# EAGLE design Main (EAGLE 9.6.2)
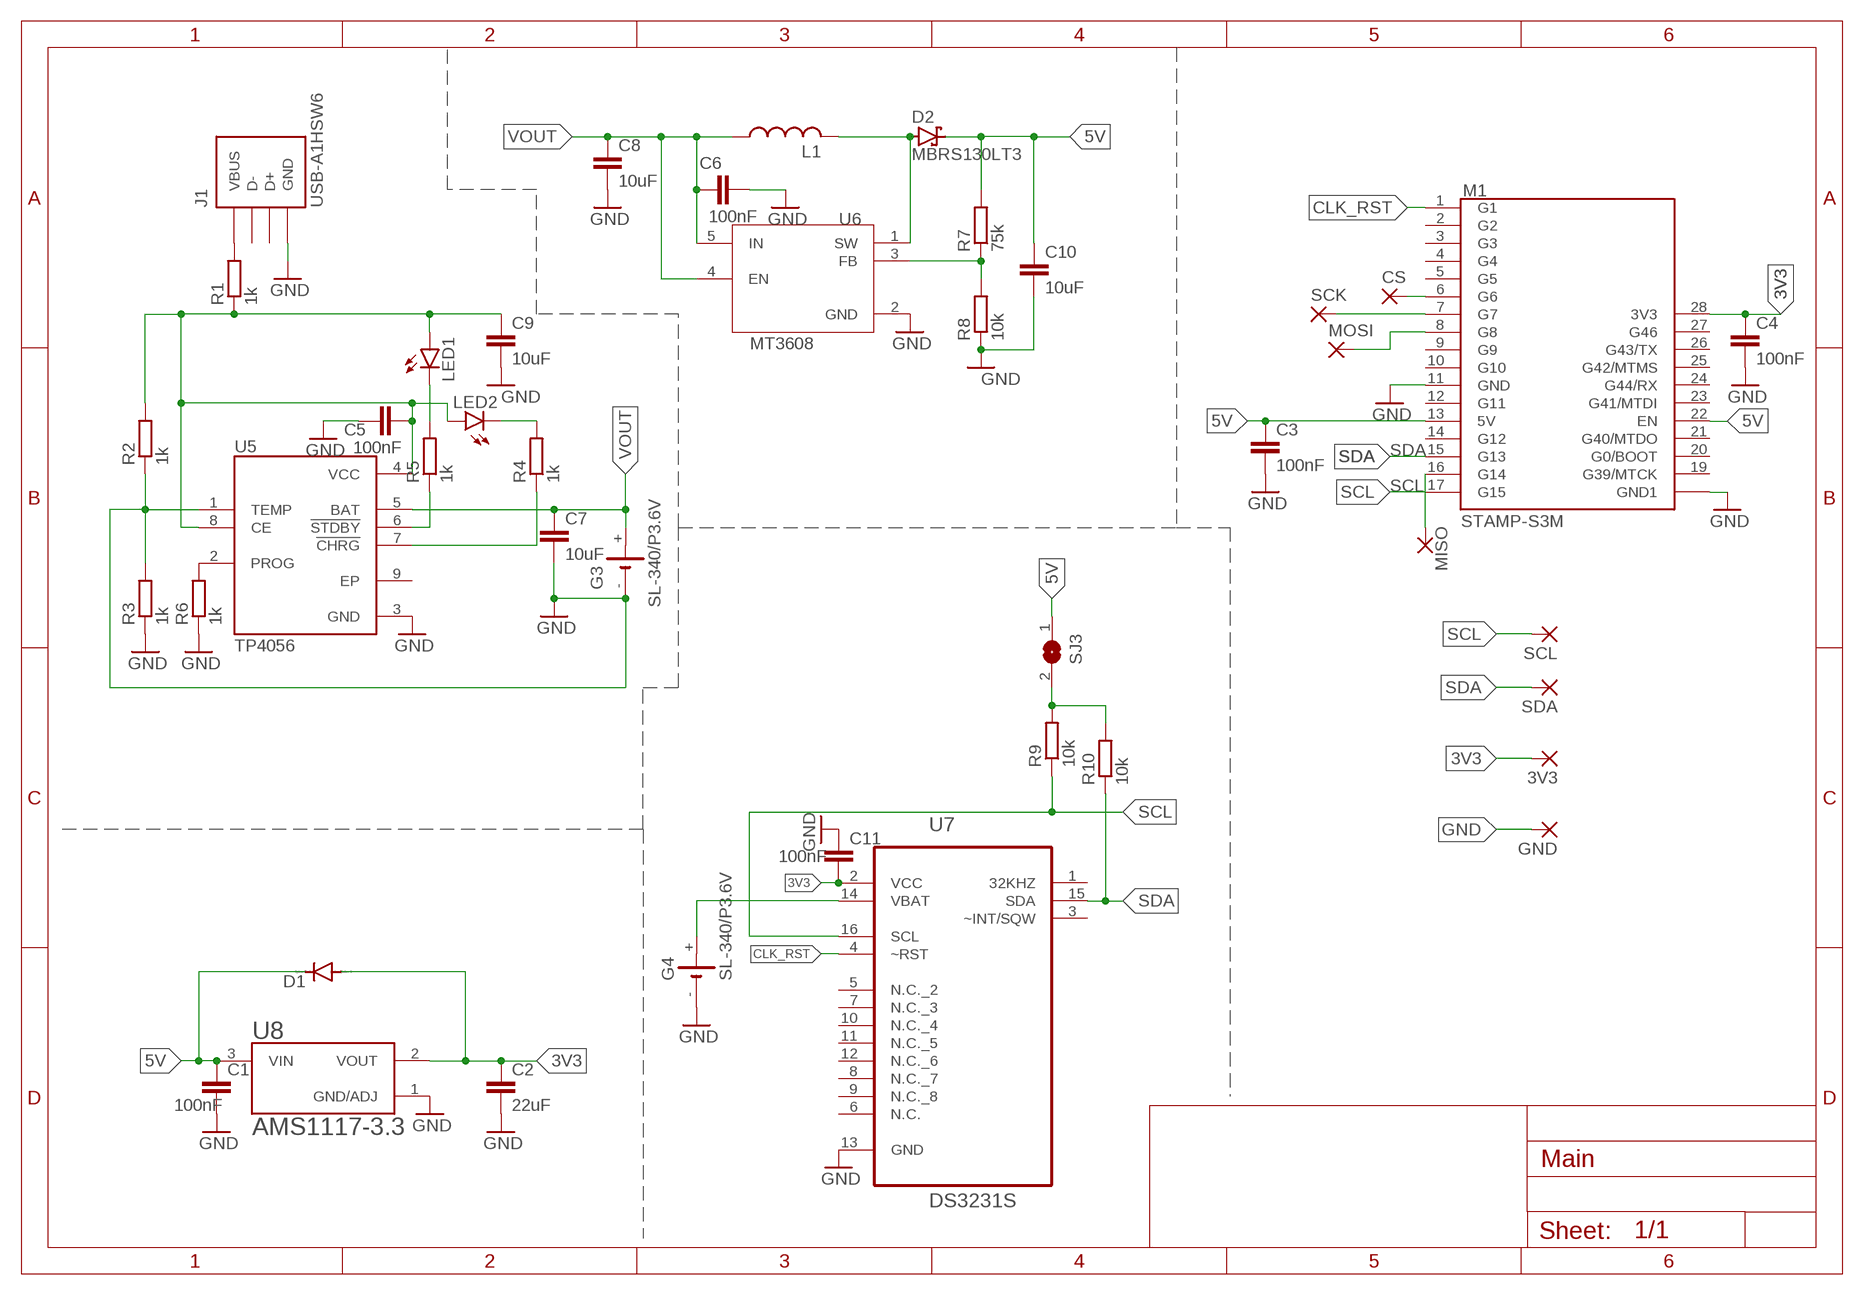
[diagram p0: schematic, sheet 1]

## Parts
3V3  1,6/0,8  [1,6/0,8]
C1  100nF  C-EUC0402  [C0402]
C2  22uF  C-EUC0402  [C0402]
C3  100nF  C-EUC0402  [C0402]
C4  100nF  C-EUC0402  [C0402]
C5  100nF  C-EUC0402  [C0402]
C6  100nF  C-EUC0402  [C0402]
C7  10uF  C-EUC0402  [C0402]
C8  10uF  C-EUC0402  [C0402]
C9  10uF  C-EUC0402  [C0402]
C10  10uF  C-EUC0402  [C0402]
C11  100nF  C-EUC0402  [C0402]
CS  1,6/0,8  [1,6/0,8]
D1  DIODE-SMB  [SMB]
D2  MBRS130LT3  [SMB]
G3  SL-340/P3.6V  [SL-340/P3.6V]
G4  SL-340/P3.6V  [SL-340/P3.6V]
GND  1,6/0,8  [1,6/0,8]
J1  USB-A1HSW6  [OST_USB-A1HSW6]
L1  L-USL3225M  [L3225M]
LED1  LEDCHIPLED_0805  [CHIPLED_0805]
LED2  LEDCHIPLED_0805  [CHIPLED_0805]
MISO  1,6/0,8  [1,6/0,8]
MOSI  1,6/0,8  [1,6/0,8]
R1  1k  R-EU_M1206  [M1206]
R2  1k  R-EU_M1206  [M1206]
R3  1k  R-EU_M1206  [M1206]
R4  1k  R-EU_M1206  [M1206]
R5  1k  R-EU_M1206  [M1206]
R6  1k  R-EU_M1206  [M1206]
R7  75k  R-EU_M1206  [M1206]
R8  10k  R-EU_M1206  [M1206]
R9  10k  R-EU_M1206  [M1206]
R10  10k  R-EU_M1206  [M1206]
SCK  1,6/0,8  [1,6/0,8]
SCL  1,6/0,8  [1,6/0,8]
SDA  1,6/0,8  [1,6/0,8]
SJ3  SJ  [SJ]
U5  TP4056  [SOP127P600X175-9N]
U6  MT3608  [SOT95P280X145-6N]
U7  DS3231S  [SOIC127P1032X265-16N]
U8  AMS1117-3.3  [SOT229P700X180-4N]
U$1  STAMP-S3M-PIN  [STAMPS3_PIN_FTP]

## Nets
3V3: 3V3.1(P) C2.1 C4.1 C11.2 D1.A U7.2(VCC) U8.2(VOUT) U$1.28(3V3)
5V: C1.1 C3.1 C10.1 D1.C D2.C R7.2 SJ3.1 U8.3(VIN) U$1.13(5V) U$1.22(EN)
CHRG: R4.1 U5.7(!CHRG)
CHRG2: LED2.C R4.2
CLK_RST: U7.4(~RST) U$1.1(G1)
CS: CS.1(P) U$1.6(G6)
FB: R7.1 R8.2 U6.3(FB)
GND: C1.2 C2.2 C3.2 C4.2 C5.1 C6.2 C7.2 C8.2 C9.2 C10.2 C11.1 G3.- G4.- GND.1(P) J1.4(GND) R2.1 R3.1 R3.2 R6.1 R8.1 U5.1(TEMP) U5.3(GND) U6.2(GND) U7.13(GND) U8.1(GND/ADJ) U$1.11(GND) U$1.18(GND1)
JUMPER: R9.2 R10.2 SJ3.2
MISO: MISO.1(P) U$1.16(G14)
MOSI: MOSI.1(P) U$1.8(G8)
N$1: R6.2 U5.2(PROG)
N$2: LED1.C R5.2
N$3: J1.1(VBUS) R1.2
SCK: SCK.1(P) U$1.7(G7)
SCL: R9.1 SCL.1(P) U7.16(SCL) U$1.17(G15)
SDA: R10.1 SDA.1(P) U7.15(SDA) U$1.15(G13)
STDBY: R5.1 U5.6(!STDBY)
SW: D2.A L1.2 U6.1(SW)
USB1: C5.2 C9.1 LED1.A LED2.A R1.1 R2.2 U5.4(VCC) U5.8(CE)
VBAT: G4.+ U7.14(VBAT)
VOUT: C6.1 C7.1 C8.1 G3.+ L1.1 U5.5(BAT) U6.4(EN) U6.5(IN)
Unconnected: J1.2(D-) J1.3(D+) U5.9(EP) U7.1(32KHZ) U7.3(~INT/SQW) U7.5(N.C._2) U7.6(N.C.) U7.7(N.C._3) U7.8(N.C._7) U7.9(N.C._8) U7.10(N.C._4) U7.11(N.C._5) U7.12(N.C._6) U$1.2(G2) U$1.3(G3) U$1.4(G4) U$1.5(G5) U$1.9(G9) U$1.10(G10) U$1.12(G11) U$1.14(G12) U$1.19(G39/MTCK) U$1.20(G0/BOOT) U$1.21(G40/MTDO) U$1.23(G41/MTDI) U$1.24(G44/RX) U$1.25(G42/MTMS) U$1.26(G43/TX) U$1.27(G46)

## Library data of the parts
3V3 CS GND MISO MOSI SCK SCL SDA = wirepad:1,6/0,8: THROUGH-HOLE PAD
C1-C11 = rcl:C-EU: CAPACITOR, European symbol; SPICEPREFIX: C
D1 = diode:DIODE-: DIODE
D2 = diode:MBRS130LT3: Schottky Power Rectifier Source: http://www.onsemi.com/pub/Collateral/MBRS130LT3-D.PDF
G3 G4 = battery:SL-340/P3.6V: LI BATTERY Sonnenschein
J1 = USB-A1HSW6:USB-A1HSW6: Check availability <https://pricing.snapeda.com/parts/USB-A1HSW6/On%20Shore/view-part?ref=eda>; AVAILABILITY: In Stock; CHECK_PRICES: https://www.snapeda.com/parts/USB-A1HSW6/ON/view-part/?ref=eda; DESCRIPTION: USB-A (USB TYPE-A) - Receptacle Connector 4 Position Through Hole, Right Angle; MF: On Shore; MP: USB-A1HSW6; PACKAGE: None; PRICE: None; SNAPEDA_LINK: https://www.snapeda.com/parts/USB-A1HSW6/ON/view-part/?ref=snap
L1 = rcl:L-US: INDUCTOR, American symbol; SPICEPREFIX: L
LED1 LED2 = led:LED: LED OSRAM: - CHIPLED LG R971, LG N971, LY N971, LG Q971, LY Q971, LO R971, LY R971 LH N974, LH R974 LS Q976, LO Q976, LY Q976 LO Q996 - Hyper CHIPLED LW Q18S LB Q993, LB Q99A, LB R99A - SideLED LS A670, LO A670, LY A670, LG A670, LP A670 LB A673, LV A673, LT A673, LW A673 LH A674 LY A675 LS A676, LA A676, LO A676, LY A676, LW A676 LS A679, LY A679, LG A679 - Hyper Micro SIDELED® LS Y876, LA Y876, LO Y876, LY Y876 LT Y87S - SmartLED LW L88C, LW L88S LB L89C, LB L89S, LG L890 LS L89K, LO L89K, LY L89K LS L896, LA L896, LO L896, LY L896 - TOPLED LS T670, LO T670, LY T670, LG T670, LP T670 LSG T670, LSP T670, LSY T670, LOP T670, LYG T670 LG T671, LOG T671, LSG T671 LB T673, LV T673, LT T673, LW T673 LH T674 LS T676, LA T676, LO T676, LY T676, LB T676, LH T676, LSB T676, LW T676 LB T67C, LV T67C, LT T67C, LS T67K, LO T67K, LY T67K, LW E67C LS E67B, LA E67B, LO E67B, LY E67B, LB E67C, LV E67C, LT E67C LW T67C LS T679, LY T679, LG T679 LS T770, LO T770, LY T770, LG T770, LP T770 LB T773, LV T773, LT T773, LW T773 LH T774 LS E675, LA E675, LY E675, LS T675 LS T776, LA T776, LO T776, LY T776, LB T776 LHGB T686 LT T68C, LB T68C - Hyper Mini TOPLED® LB M676 - Mini TOPLED Santana® LG M470 LS M47K, LO M47K, LY M47K Source: http://www.osram.convergy.de LUXEON: - LUMILED® LXK2-PW12-R00, LXK2-PW12-S00, LXK2-PW14-U00, LXK2-PW14-V00 LXK2-PM12-R00, LXK2-PM12-S00, LXK2-PM14-U00 LXK2-PE12-Q00, LXK2-PE12-R00, LXK2-PE12-S00, LXK2-PE14-T00, LXK2-PE14-U00 LXK2-PB12-K00, LXK2-PB12-L00, LXK2-PB12-M00, LXK2-PB14-N00, LXK2-PB14-P00, LXK2-PB14-Q00 LXK2-PR12-L00, LXK2-PR12-M00, LXK2-PR14-Q00, LXK2-PR14-R00 LXK2-PD12-Q00, LXK2-PD12-R00, LXK2-PD12-S00 LXK2-PH12-R00, LXK2-PH12-S00 LXK2-PL12-P00, LXK2-PL12-Q00, LXK2-PL12-R00 Source: www.luxeon.com KINGBRIGHT: KA-3528ASYC Source: www.kingbright.com
R1-R10 = rcl:R-EU_: RESISTOR, European symbol; SPICEPREFIX: R
SJ3 = jumper:SJ: SMD solder JUMPER
U5 = TP4056:TP4056: Check availability <https://pricing.snapeda.com/parts/TP4056/NanJing%20Top%20Power%20ASIC%20Corp./view-part?ref=eda>; AVAILABILITY: Not in stock; CHECK_PRICES: https://www.snapeda.com/parts/TP4056/NanJing+Top+Power+ASIC+Corp./view-part/?ref=eda; DESCRIPTION: Complete single cell Li-Ion battery with a constant current / constant voltage linear charger; MF: NanJing Top Power ASIC Corp.; MP: TP4056; PACKAGE: Package; PRICE: None; SNAPEDA_LINK: https://www.snapeda.com/parts/TP4056/NanJing+Top+Power+ASIC+Corp./view-part/?ref=snap
U6 = MT3608:MT3608: Check availability <https://pricing.snapeda.com/parts/MT3608/Aerosemi%20Technology%20Co.%2C%20Ltd/view-part?ref=eda>; AVAILABILITY: Not in stock; CHECK_PRICES: https://www.snapeda.com/parts/MT3608/Aerosemi+Technology+Co.%252C+Ltd/view-part/?ref=eda; DESCRIPTION: High Efficiency 1.2MHz 2A Step Up Converter; MF: Aerosemi Technology Co., Ltd; MP: MT3608; PACKAGE: Package; PRICE: None; SNAPEDA_LINK: https://www.snapeda.com/parts/MT3608/Aerosemi+Technology+Co.%252C+Ltd/view-part/?ref=snap
U7 = DS3231S:DS3231S: Check availability <https://pricing.snapeda.com/parts/DS3231S%23/Analog%20Devices/view-part?ref=eda>; AVAILABILITY: In Stock; CHECK_PRICES: https://www.snapeda.com/parts/DS3231S%23/Analog+Devices/view-part/?ref=eda; DESCRIPTION: Extremely Accurate I²C-Integrated RTC/TCXO/Crystal; MF: Analog Devices; MP: DS3231S#; PACKAGE: SOIC-16 Maxim; PRICE: None; SNAPEDA_LINK: https://www.snapeda.com/parts/DS3231S%23/Analog+Devices/view-part/?ref=snap
U8 = AMS1117-3.3:AMS1117-3.3: Check availability <https://pricing.snapeda.com/parts/AMS1117-3.3/Advanced%20Monolithic%20Systems/view-part?ref=eda>; AVAILABILITY: Not in stock; CHECK_PRICES: https://www.snapeda.com/parts/AMS1117-3.3/Advanced+Monolithic+Systems/view-part/?ref=eda; DESCRIPTION: Sot223/Pkg 1-Amp 3.3-Volt Low Drop Out Voltage Regulatator; MF: Advanced Monolithic Systems; MP: AMS1117-3.3; PACKAGE: SOT-223 Seeed Technology; PRICE: None; SNAPEDA_LINK: https://www.snapeda.com/parts/AMS1117-3.3/Advanced+Monolithic+Systems/view-part/?ref=snap
U$1 = StampS3:STAMP-S3M-PIN

## Board
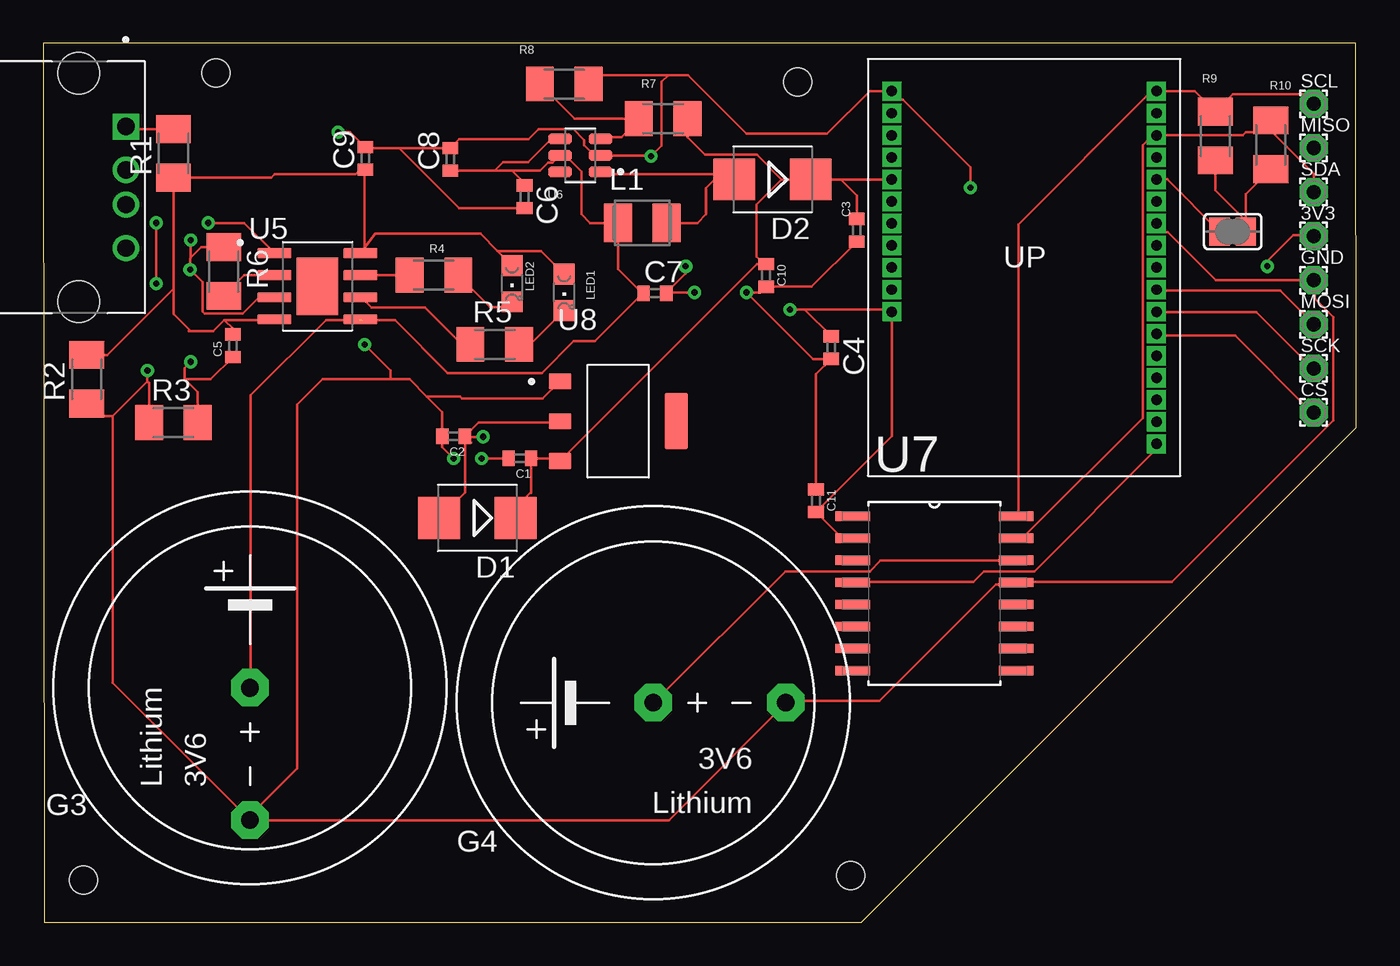
[diagram p1: board, top side]
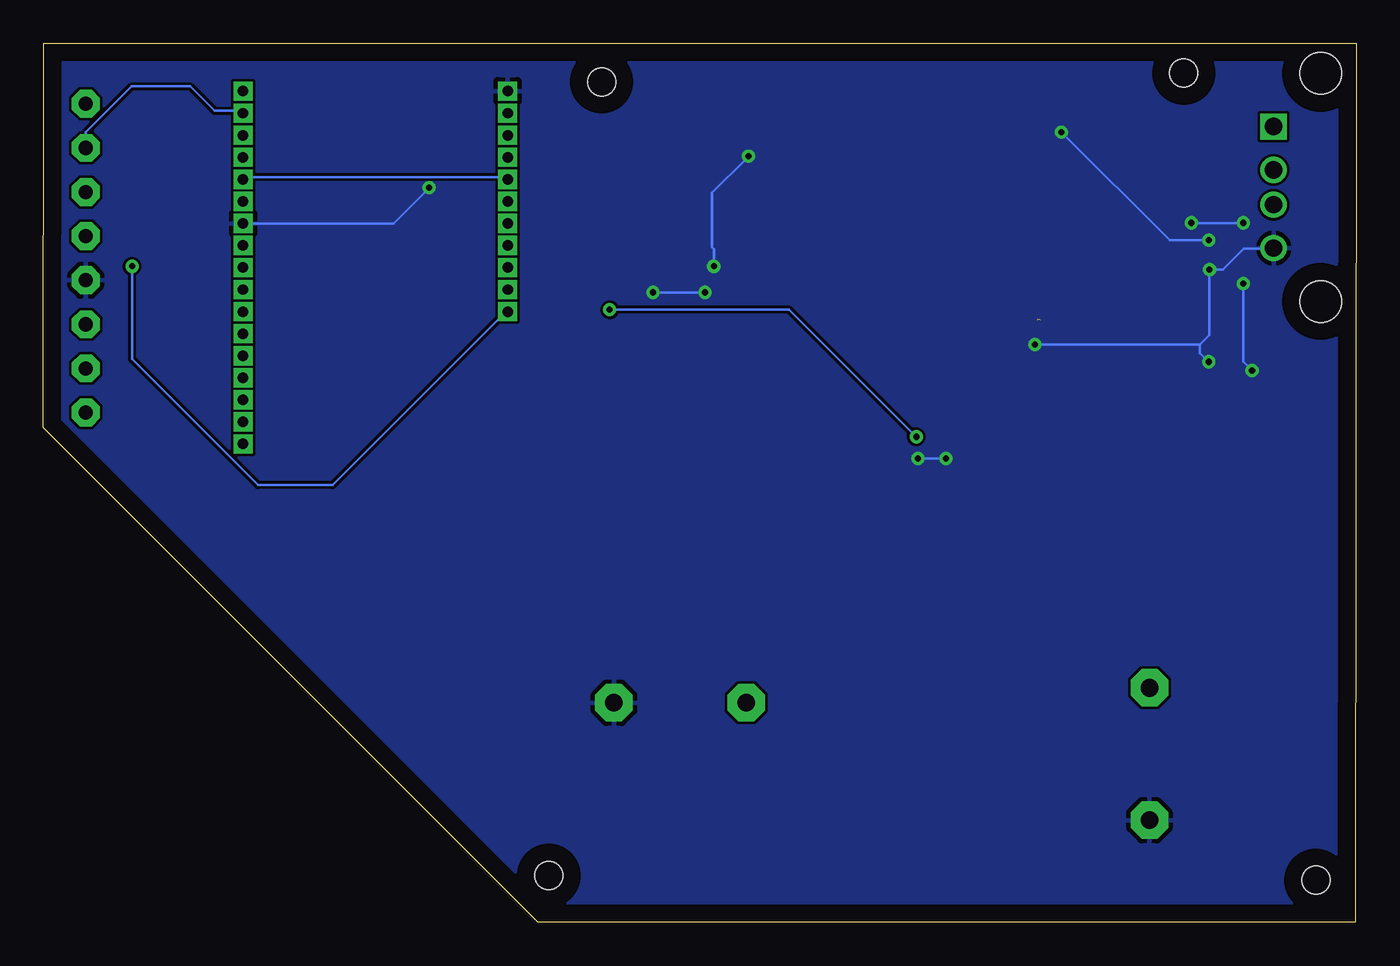
[diagram p2: board, bottom side, seen from below]

Size 75.6 x 50.62 mm. Coordinates in mm from the lower left corner, seen from the top.
Outline: 0.04,0 47.12,0 75.6,28.5 75.58,50.62 0,50.62 0.04,0
Copper layers (1*16): Top 0.035mm / dielectric 1.5mm / Bottom 0.035mm
Design rules "default": minimum track width 6mil, minimum drill 0.35mm, track to track 6mil, track to pad 6mil, pad to pad 6mil, via to via 6mil, smd to smd 6mil, copper to edge 40mil, drill to drill 6mil, minimum pad ring 10mil, minimum via ring 8mil, stop-mask expansion 4mil, vias tented up to drill 0mil, thermal gap 10mil
Holes 1.6 mm at 46.49,2.69 9.93,48.91 43.45,48.41 2.31,2.42

### Footprints (pad centres in the part's own frame; a part is rotated, then mirrored left to right if it is on the bottom)
1,6/0,8 = drill 0.813 pad 1.6 octagon: 1 0,0
C0402 = smd 0.7 x 0.9: 1 -0.65,0; 2 0.65,0
SMB = smd 2.4 x 2.4: A 2.2,0; C -2.2,0
SL-340/P3.6V = drill 1.016 pad 2.159 octagon: + 0,0; - -7.62,0
OST_USB-A1HSW6 = drill 1 square: 1 -3.5,2.71 | drill 1: 2 -1,2.71; 3 1,2.71; 4 3.5,2.71 | hole 2.38: -6.57,0; 6.57,0
L3225M = smd 1.6 x 2.2: 1 -1.4,0; 2 1.4,0
CHIPLED_0805 = smd 1.2 x 1.2: A 0,-1.05; C 0,1.05
M1206 = smd 1.6 x 2: 1 -1.4,0; 2 1.4,0
SJ = smd 1.168 x 1.6: 1 -0.762,0; 2 0.762,0
SOP127P600X175-9N = smd 1.97 x 0.6: 1 -2.475,1.905; 2 -2.475,0.635; 3 -2.475,-0.635; 4 -2.475,-1.905; 5 2.475,-1.905; 6 2.475,-0.635; 7 2.475,0.635; 8 2.475,1.905 | smd 2.413 x 3.302: 9 0,0
SOT95P280X145-6N = smd 1.37 x 0.59: 1 -1.17,0.95; 2 -1.17,0; 3 -1.17,-0.95; 4 1.17,-0.95; 5 1.17,0; 6 1.17,0.95
SOIC127P1032X265-16N = smd 1.981 x 0.533: 1 -4.699,4.445; 2 -4.699,3.175; 3 -4.699,1.905; 4 -4.699,0.635; 5 -4.699,-0.635; 6 -4.699,-1.905; 7 -4.699,-3.175; 8 -4.699,-4.445; 9 4.699,-4.445; 10 4.699,-3.175; 11 4.699,-1.905; 12 4.699,-0.635; 13 4.699,0.635; 14 4.699,1.905; 15 4.699,3.175; 16 4.699,4.445
SOT229P700X180-4N = smd 1.31 x 0.93: 1 -3.345,2.29; 2 -3.345,0; 3 -3.345,-2.29 | smd 1.31 x 3.24: 4 3.345,0
STAMPS3_PIN_FTP = drill 0.6 square: 1 -3.81,7.62; 2 -3.81,6.35; 3 -3.81,5.08; 4 -3.81,3.81; 5 -3.81,2.54; 6 -3.81,1.27; 7 -3.81,0; 8 -3.81,-1.27; 9 -3.81,-2.54; 10 -3.81,-3.81; 11 -3.81,-5.08; 12 -3.81,-6.35; 13 -3.81,-7.62; 14 -3.81,-8.89; 15 -3.81,-10.16; 16 -3.81,-11.43; 17 -3.81,-12.7; 18 11.43,-12.7; 19 11.43,-11.43; 20 11.43,-10.16; 21 11.43,-8.89; 22 11.43,-7.62; 23 11.43,-6.35; 24 11.43,-5.08; 25 11.43,-3.81; 26 11.43,-2.54; 27 11.43,-1.27; 28 11.43,0

### Placement (x,y rotation side)
3V3  73.16,39.52 0 top
C1  27.43,26.72 180 top
C2  23.62,27.99 180 top
C3  46.84,39.86 270 top
C4  45.37,33.1 270 top
C5  10.92,33.21 90 top
C6  27.71,41.79 270 top
C7  35.22,36.23 0 top
C8  23.43,43.94 90 top
C9  18.54,44 90 top
C10  41.62,37.25 270 top
C11  44.49,24.28 270 top
CS  73.16,29.36 0 top
D1  24.99,23.28 180 top
D2  41.99,42.78 180 top
G3  11.9,13.5 90 top
G4  35.12,12.64 180 top
GND  73.16,36.98 0 top
J1  2.04,42.33 270 top
L1  34.49,40.28 0 top
LED1  29.99,36.28 180 top
LED2  26.99,36.78 180 top
MISO  73.16,44.6 0 top
MOSI  73.16,34.44 0 top
R1  7.49,44.28 90 top
R2  2.49,31.28 90 top
R3  7.49,28.78 0 top
R4  22.49,37.28 0 top
R5  25.99,33.28 0 top
R6  10.39,37.48 270 top
R7  35.69,46.28 0 top
R8  29.99,48.28 180 top
R9  67.49,45.28 270 top
R10  70.69,44.78 270 top
SCK  73.16,31.9 0 top
SCL  73.16,47.14 0 top
SDA  73.16,42.06 0 top
SJ3  68.49,39.78 0 top
U5  15.78,36.63 0 top
U6  30.92,44.17 180 top
U7  51.31,18.94 0 top
U8  33.1,28.86 0 top
U$1  60.29,35.17 180 top

### Tracks (layer width: path | path; a pad name or v marks a point on that pad's centre or on a via)
3V3  (via drill 0.35)
  Top 0.152: U$1.28 48.98,35.15 | 47.15,22.2 46.69,22.2 U7.2 46.01,22.12 C11.2 48.86,28 U$1.28 | U$1.28 48.83,35.15 48.7,35.28 43.84,35.28 | 29.62,28.75 U8.2 29.67,28.78 25.06,28.78 C2.1 | 3V3.1 73.06,39.57 71.99,39.57 70.49,38.07 v70.49,37.78 | 24.62,27.64 C2.1 | v25.33,27.96 24.3,27.96 C2.1 | v42.99,35.28 43.84,35.28 | 43.84,35.28 C4.1 | C2.1 24.27,24.76 D1.A
  Bottom 0.152: 48.83,35.15 U$1.28 48.98,35.15 58.95,25.18 63.24,25.18 70.49,32.43 v70.49,37.78 | v25.33,27.96 32.65,35.28 v42.99,35.28
5V
  Top 0.152: 45.93,42.77 48.83,42.77 U$1.22 | 28.08,24.78 C1.1 29.6,26.72 U8.3 41.09,37.9 41.49,37.9 | 28.08,24.78 28.08,24.72 | 41.49,37.9 C10.1 | 41.49,37.9 41.05,38.34 41.05,41.32 42.51,42.78 | D1.C 27.19,23.89 28.08,24.78 | 42.51,42.78 D2.C 45.92,42.78 45.93,42.77 | 42.51,42.78 41.09,44.21 38.09,44.21 37.09,45.21 R7.2 | 45.93,42.77 46.84,41.86 C3.1 | U$1.13 64.72,42.79 SJ3.1
  Bottom 0.152: U$1.13 64.07,42.92 48.98,42.92 U$1.22
CHRG
  Top 0.152: U5.7 18.35,37.29 R4.1
CHRG2
  Top 0.152: LED2.C 26.7,35.44 25.99,35.44 25.73,35.44 R4.2
CLK_RST
  Top 0.152: U7.4 46.69,19.61 53.55,19.61 54.16,20.22 57.06,20.22 64.07,27.23 64.07,27.53 U$1.1
CS
  Top 0.152: 64.52,33.78 64.22,33.78 U$1.6 64.52,33.78 | 64.52,33.78 68.64,33.78 73.06,29.36 CS.1
FB
  Top 0.152: U6.3 32.22,45.21 33.28,45.21 34.29,46.22 R7.1 30.59,46.28 R8.2
GND  (via drill 0.35)
  Top 0.152: 31.82,44.17 U6.2 | U6.2 32.22,44.14 34.96,44.14 v35,44.12 35.61,44.73 35.61,48.4 35.99,48.78 | U6.2 31.76,44.14 31.15,44.75 31.15,45.06 30.54,45.67 28.51,45.67 27.94,45.09 23.93,45.09 C8.2 20.49,44.59 | 13.17,35.91 U5.3 12.43,36 11.48,35.05 9.29,35.05 9.16,35.19 9.16,36.87 v8.44,37.59 8.44,38.23 8.49,38.28 | 22.08,30.28 23.99,30.28 24.12,30.15 28.75,30.15 U8.1 | 19.99,31.28 21.08,31.28 22.08,30.28 | 19.99,31.28 16.08,31.28 14.62,29.82 14.62,8.86 11.95,6.18 11.95,5.89 G3.- 3.99,13.79 3.99,29.15 | v8.49,32.28 8.14,31.93 8.14,31.28 | v6.49,40.28 v6.49,36.78 | v5.99,31.78 5.99,31.15 | 5.99,31.15 3.99,29.15 | G3.- 36.02,5.88 42.73,12.6 G4.- 42.88,12.75 48.15,12.75 54.86,19.45 55.99,19.45 U7.13 56.14,19.61 64.98,19.61 74.28,28.9 74.28,34.85 73.21,35.91 73.21,36.98 GND.1 67.53,36.98 64.75,39.76 64.59,39.76 U$1.11 | v53.39,42.32 53.39,43.5 49.51,47.38 49.35,47.38 U$1.18 47.59,47.87 45.13,45.41 40.49,45.41 37.12,48.78 35.99,48.78 | 22.08,30.28 22.97,29.39 C2.2 22.97,27.37 v23.62,26.72 | C1.2 v25.23,26.72 | v16.97,45.51 17.68,45.51 C9.2 18.6,44.59 20.49,44.59 | v36.99,37.78 36.99,37.35 C7.2 35.92,36.28 v37.49,36.28 | C3.2 44.23,36.6 C10.2 41.3,36.28 v40.49,36.28 44.32,32.45 C4.2 44.49,31.57 C11.1 | C5.1 9.64,31.28 9.49,31.28 8.14,31.28 | C6.2 23.94,41.14 20.49,44.59 | v18.49,33.28 19.99,31.78 19.99,31.28 | 5.99,31.15 6.09,31.05 R3.1 | 8.14,31.28 8.89,30.53 R3.2 | v9.49,40.28 11.56,40.28 U5.1 | R6.1 9.09,38.88 8.49,38.28 | v8.49,39.28 8.49,38.28 | R8.1 31.89,48.78 35.99,48.78 | 3.99,29.15 3.22,29.15 R2.1
  Bottom 0.152: v35,44.12 35.11,43.99 37.09,42.01 37.09,38.88 36.99,38.78 v36.99,37.78 | J1.4 4.78,38.81 6.46,38.81 7.68,37.59 v8.44,37.59 8.44,33.83 8.99,33.28 | 8.99,33.28 8.99,32.78 v8.49,32.28 | v9.49,40.28 v6.49,40.28 | v6.49,36.78 6.49,32.28 v5.99,31.78 | U$1.11 55.42,40.25 53.39,42.28 v53.39,42.32 | v25.23,26.72 v23.62,26.72 | v37.49,36.28 v40.49,36.28 | 8.99,33.28 v18.49,33.28 | v16.97,45.51 10.74,39.28 v8.49,39.28
  pour Bottom: 0.09,0.08 47.09,0.08 75.49,28.48 75.49,28.58 75.49,50.38 75.39,50.48 0.09,50.48
JUMPER
  Top 0.152: R9.2 67.49,42.16 69.25,40.4 SJ3.2 69.25,41.94 R10.2
MISO
  Bottom 0.152: MISO.1 73.16,45.5 70.51,48.15 67.16,48.15 65.74,46.73 64.22,46.73 U$1.16
MOSI
  Top 0.152: 64.22,36.52 U$1.8 64.22,36.37 71.23,36.37 MOSI.1
N$1
  Top 0.152: U5.2 11.58,37.27 R6.2
N$2
  Top 0.152: R5.2 28.04,33.28 LED1.C
N$3
  Top 0.152: R1.2 4.9,45.68 J1.1
SCK
  Top 0.152: U$1.7 64.22,35.15 69.86,35.15 73.06,31.95 SCK.1
SCL
  Top 0.152: U7.16 56.14,23.42 56.14,40.18 63.76,47.8 64.07,47.8 U$1.17 | 64.22,47.95 U$1.17 | U$1.17 66.3,47.87 R9.1 68.49,47.68 72.62,47.68 SCL.1
SDA
  Top 0.152: U7.15 56.14,22.2 56.45,22.2 63.3,29.05 63.3,44.75 63.76,45.21 64.07,45.21 U$1.15 69.06,45.33 69.25,45.51 70.02,45.51 R10.1 70.69,45.58 73.16,43.11 SDA.1
STDBY
  Top 0.152: U5.6 18.91,35.41 21.99,35.41 24.12,33.28 R5.1
SW
  Top 0.152: 32.19,43.12 U6.1 32.22,43.08 39.35,43.08 39.72,42.71 D2.A 38.66,42.78 38.16,42.28 38.16,40.78 37.66,40.28 L1.2
USB1
  Top 0.152: 18.19,38.66 U5.8 | 26.16,38.66 28.66,38.66 LED1.A | U5.8 19.1,39.66 25.16,39.66 26.16,38.66 | 10.42,34.69 13.17,34.69 U5.4 | 10.42,34.69 9.77,34.04 8.49,34.04 | 8.36,34.04 8.49,34.04 | 18.49,43.35 18.26,43.35 17.99,43.08 13.32,43.08 13.12,42.88 R1.1 7.49,36.49 | 18.49,43.35 C9.1 | U5.8 18.49,38.77 18.49,43.35 | 10.42,34.69 10.92,34.2 C5.2 | LED2.A 26.16,38.66 | 7.49,36.49 3.68,32.68 R2.2 | 8.49,34.04 7.49,35.04 7.49,36.49
VBAT
  Top 0.152: 56.23,20.62 U7.14 55.99,20.83 48.22,20.83 47.61,20.22 42.73,20.22 35.26,12.75 G4.+
VOUT  (2 unrouted)
  Top 0.152: 29.78,44.3 U6.5 | 29.78,45.06 U6.4 29.25,45.12 27.91,43.78 26.48,43.78 25.99,43.29 | U6.5 29.78,44.14 30.08,44.14 30.99,43.23 30.99,40.78 31.49,40.28 L1.1 33.09,37.61 34.49,36.21 | 29.32,44.14 29.62,44.14 U6.5 | 18.35,34.69 20.24,34.69 23.29,31.65 28.71,31.65 30.54,33.48 31.76,33.48 34.49,36.21 | 18.19,34.69 16.28,34.69 11.95,30.36 11.95,13.51 G3.+ | U6.5 29.32,43.74 29.06,43.74 28.6,43.29 26.99,43.29 | 26.99,43.29 25.99,43.29 | 25.99,43.29 C8.1 | 34.48,36.23 34.49,36.23 | 34.49,36.23 C7.1 | 34.49,36.21 34.49,36.23 | 26.99,43.29 27.71,42.57 C6.1